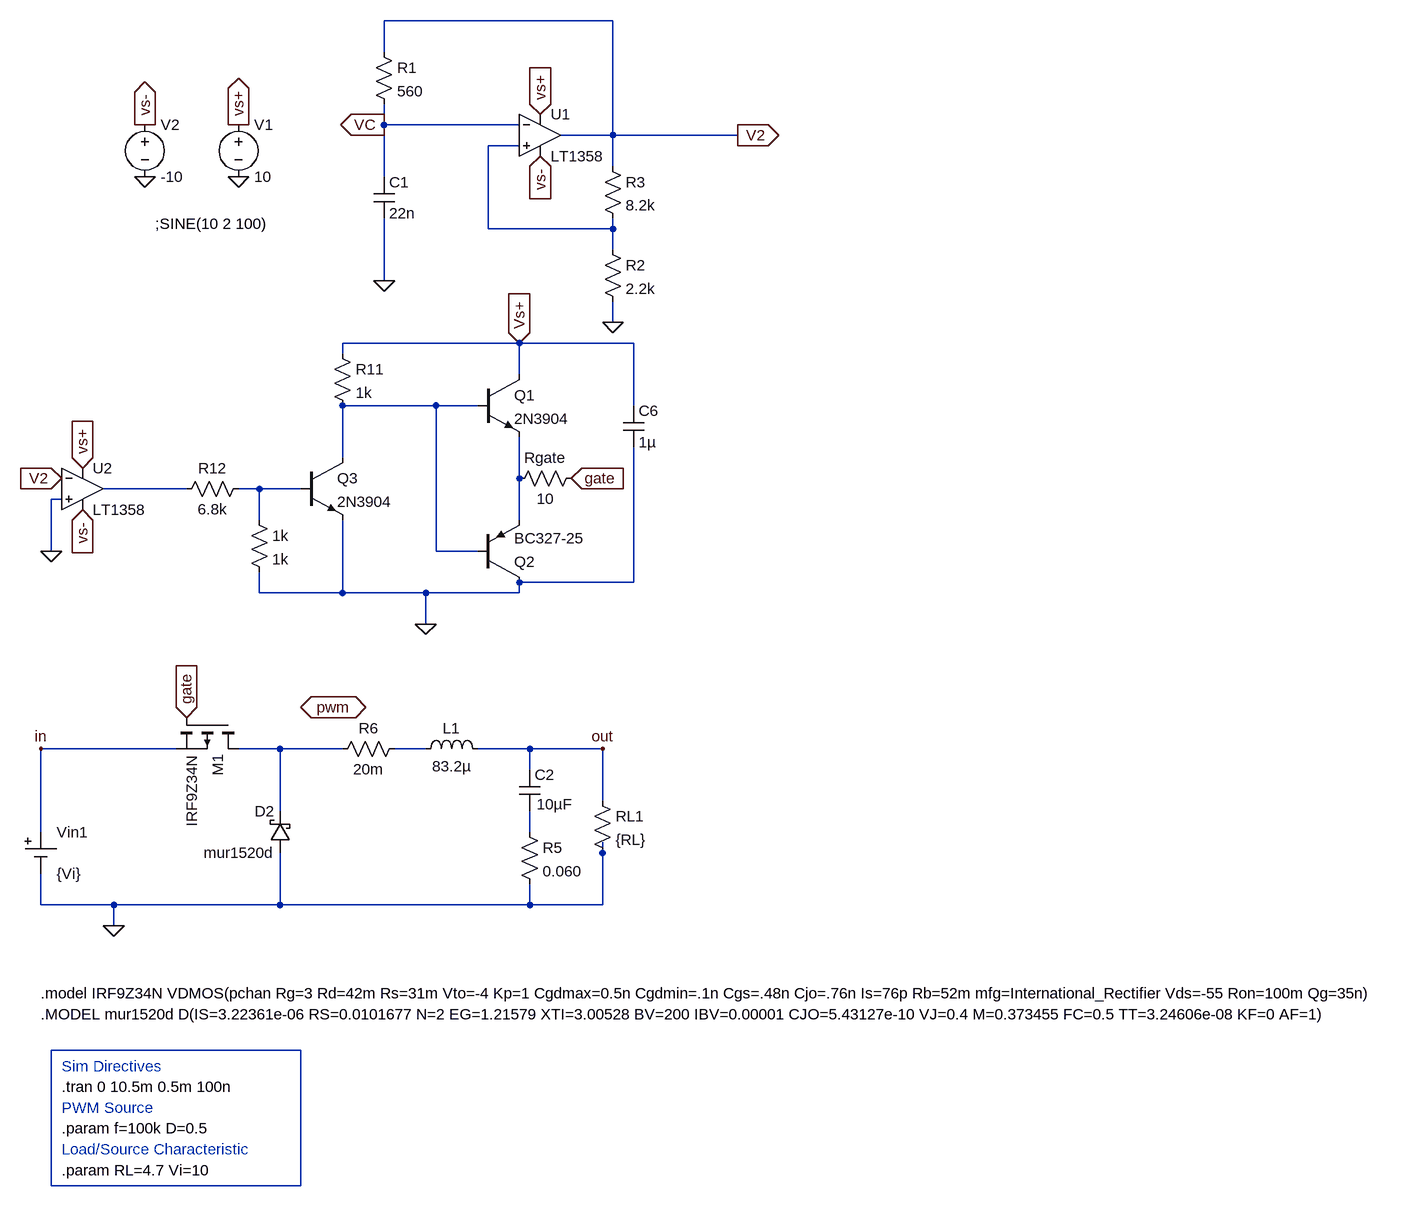
[diagram p0: schematic Complete.asc]
Complete.asc, the LTspice schematic file:
Version 4
SHEET 1 2268 1636
WIRE 80 -160 -272 -160
WIRE -272 -112 -272 -160
WIRE -272 0 -272 -32
WIRE -64 0 -272 0
WIRE 80 16 80 -160
WIRE 80 16 0 16
WIRE 272 16 80 16
WIRE -64 32 -112 32
WIRE 80 64 80 16
WIRE -272 80 -272 0
WIRE -112 160 -112 32
WIRE 80 160 80 144
WIRE 80 160 -112 160
WIRE 80 192 80 160
WIRE -272 240 -272 144
WIRE 80 304 80 272
WIRE -64 336 -336 336
WIRE 112 336 -64 336
WIRE -336 352 -336 336
WIRE -64 384 -64 336
WIRE -192 432 -336 432
WIRE -128 432 -192 432
WIRE 112 432 112 336
WIRE -336 512 -336 432
WIRE -64 544 -64 480
WIRE -576 560 -704 560
WIRE -464 560 -496 560
WIRE -400 560 -464 560
WIRE -768 576 -784 576
WIRE -464 608 -464 560
WIRE -64 608 -64 544
WIRE -784 656 -784 576
WIRE -192 656 -192 432
WIRE -128 656 -192 656
WIRE 112 704 112 496
WIRE 112 704 -64 704
WIRE -464 720 -464 688
WIRE -336 720 -336 608
WIRE -336 720 -464 720
WIRE -208 720 -336 720
WIRE -64 720 -64 704
WIRE -64 720 -208 720
WIRE -208 768 -208 720
WIRE -592 960 -800 960
WIRE -432 960 -496 960
WIRE -336 960 -432 960
WIRE -208 960 -256 960
WIRE -48 960 -128 960
WIRE 64 960 -48 960
WIRE -48 992 -48 960
WIRE 64 1040 64 960
WIRE -432 1056 -432 960
WIRE -800 1088 -800 960
WIRE -48 1088 -48 1056
WIRE 64 1120 64 1104
WIRE -800 1200 -800 1152
WIRE -688 1200 -800 1200
WIRE -432 1200 -432 1120
WIRE -432 1200 -688 1200
WIRE -48 1200 -48 1168
WIRE -48 1200 -432 1200
WIRE 64 1200 64 1120
WIRE 64 1200 -48 1200
WIRE -688 1232 -688 1200
FLAG 80 304 0
FLAG -272 240 0
FLAG 272 16 V2
IOPIN 272 16 Out
FLAG -496 80 0
FLAG -640 80 0
FLAG -768 544 V2
IOPIN -768 544 In
FLAG -496 0 vs+
IOPIN -496 0 Out
FLAG -640 0 vs-
IOPIN -640 0 Out
FLAG -32 -16 vs+
IOPIN -32 -16 In
FLAG -736 528 vs+
IOPIN -736 528 In
FLAG -32 48 vs-
IOPIN -32 48 In
FLAG -736 592 vs-
IOPIN -736 592 In
FLAG 16 544 gate
IOPIN 16 544 In
FLAG -208 768 0
FLAG -272 0 VC
IOPIN -272 0 Out
FLAG -64 336 Vs+
IOPIN -64 336 In
FLAG -784 656 0
FLAG -688 1232 0
FLAG -800 960 in
FLAG 64 960 out
FLAG -400 896 pwm
IOPIN -400 896 BiDir
FLAG -576 912 gate
IOPIN -576 912 In
SYMBOL cap -288 80 R0
SYMATTR InstName C1
SYMATTR Value 22n
SYMBOL res -288 -128 R0
SYMATTR InstName R1
SYMATTR Value 560
SYMBOL Opamps\\LT1358 -32 -48 R0
SYMATTR InstName U1
SYMBOL res 64 48 R0
SYMATTR InstName R3
SYMATTR Value 8.2k
SYMBOL res 64 176 R0
SYMATTR InstName R2
SYMATTR Value 2.2k
SYMBOL voltage -496 -16 R0
WINDOW 123 0 0 Left 0
WINDOW 39 0 0 Left 0
SYMATTR InstName V1
SYMATTR Value 10
SYMBOL voltage -640 -16 R0
WINDOW 123 0 0 Left 0
WINDOW 39 0 0 Left 0
SYMATTR InstName V2
SYMATTR Value -10
SYMBOL Opamps\\LT1358 -736 496 R0
SYMATTR InstName U2
SYMBOL res -480 544 R90
WINDOW 0 0 56 VBottom 2
WINDOW 3 32 56 VTop 2
SYMATTR InstName R12
SYMATTR Value 6.8k
SYMBOL res -480 592 R0
SYMATTR InstName 1k
SYMATTR Value 1k
SYMBOL npn -400 512 R0
SYMATTR InstName Q3
SYMATTR Value 2N3904
SYMBOL res -352 336 R0
SYMATTR InstName R11
SYMATTR Value 1k
SYMBOL res 32 528 R90
WINDOW 0 0 56 VBottom 2
WINDOW 3 32 56 VTop 2
SYMATTR InstName Rgate
SYMATTR Value 10
SYMBOL cap 96 432 R0
SYMATTR InstName C6
SYMATTR Value 1µ
SYMBOL pnp -128 704 M180
SYMATTR InstName Q2
SYMATTR Value BC327-25
SYMBOL npn -128 384 R0
SYMATTR InstName Q1
SYMATTR Value 2N3904
SYMBOL Misc\\cell -800 1088 R0
SYMATTR InstName Vin1
SYMATTR Value {Vi}
SYMBOL cap -64 992 R0
WINDOW 3 27 53 Left 2
SYMATTR Value 10µF
SYMATTR InstName C2
SYMBOL schottky -416 1120 R180
WINDOW 0 24 64 Left 2
WINDOW 3 24 0 Left 2
SYMATTR InstName D2
SYMATTR Value mur1520d
SYMATTR Description Diode
SYMATTR Type diode
SYMBOL res 48 1024 R0
SYMATTR InstName RL1
SYMATTR Value {RL}
SYMBOL res -64 1072 R0
SYMATTR InstName R5
SYMATTR Value 0.060
SYMBOL pmos -496 912 R90
SYMATTR InstName M1
SYMATTR Value IRF9Z34N
SYMBOL ind -224 976 R270
WINDOW 0 32 56 VTop 2
WINDOW 3 5 56 VBottom 2
SYMATTR InstName L1
SYMATTR Value 83.2µ
SYMBOL res -240 944 R90
WINDOW 0 0 56 VBottom 2
WINDOW 3 32 56 VTop 2
SYMATTR InstName R6
SYMATTR Value 20m
TEXT -800 1368 Left 2 !.MODEL mur1520d D(IS=3.22361e-06 RS=0.0101677 N=2 EG=1.21579 XTI=3.00528 BV=200 IBV=0.00001 CJO=5.43127e-10 VJ=0.4 M=0.373455 FC=0.5 TT=3.24606e-08 KF=0 AF=1)
TEXT -800 1336 Left 2 !.model IRF9Z34N VDMOS(pchan Rg=3 Rd=42m Rs=31m Vto=-4 Kp=1 Cgdmax=0.5n Cgdmin=.1n Cgs=.48n Cjo=.76n Is=76p Rb=52m mfg=International_Rectifier Vds=-55 Ron=100m Qg=35n)
TEXT -768 1480 Left 2 !.tran 0 10.5m 0.5m 100n
TEXT -768 1544 Left 2 !.param f=100k D=0.5
TEXT -768 1448 Left 2 ;Sim Directives
TEXT -768 1512 Left 2 ;PWM Source
TEXT -768 1608 Left 2 !.param RL=4.7 Vi=10
TEXT -768 1576 Left 2 ;Load/Source Characteristic
TEXT -624 152 Left 2 !;SINE(10 2 100)
RECTANGLE Normal -400 1632 -784 1424

The netlist it stands for:
* Complete.asc
C1 VC 0 22n
R1 V2 VC 560
XU1 N001 VC vs+ vs- V2 LT1357  ; LT1358, pins In+ In- V+ V- OUT
R3 V2 N001 8.2k
R2 N001 0 2.2k
V1 vs+ 0 10
V2 vs- 0 -10
XU2 0 V2 vs+ vs- N004 LT1357  ; LT1358, pins In+ In- V+ V- OUT
R12 N005 N004 6.8k
R§1k N005 0 1k
Q3 N002 N005 0 0 2N3904
R11 vs+ N002 1k
Rgate gate N003 10
C6 vs+ 0 1µ
Q2 0 N002 N003 0 BC327-25
Q1 vs+ N002 N003 0 2N3904
Vin1 in 0 {Vi}
C2 out N008 10µF
D2 0 N006 mur1520d
RL1 out 0 {RL}
R5 N008 0 0.060
M1 N006 gate in in IRF9Z34N
L1 N007 out 83.2µ
R6 N007 N006 20m
.model D D
.lib standard.dio
.model NPN NPN
.model PNP PNP
.lib standard.bjt
.model NMOS NMOS
.model PMOS PMOS
.lib standard.mos
.MODEL mur1520d D(IS=3.22361e-06 RS=0.0101677 N=2 EG=1.21579 XTI=3.00528 BV=200 IBV=0.00001 CJO=5.43127e-10 VJ=0.4 M=0.373455 FC=0.5 TT=3.24606e-08 KF=0 AF=1)
.model IRF9Z34N VDMOS(pchan Rg=3 Rd=42m Rs=31m Vto=-4 Kp=1 Cgdmax=0.5n Cgdmin=.1n Cgs=.48n Cjo=.76n Is=76p Rb=52m mfg=International_Rectifier Vds=-55 Ron=100m Qg=35n)
.tran 0 10.5m 0.5m 100n
.param f=100k D=0.5
* Sim Directives
* PWM Source
.param RL=4.7 Vi=10
* Load/Source Characteristic
;SINE(10 2 100)
.lib LTC.lib
.backanno
.end